# EAGLE design fan control (EAGLE 9.3.2)
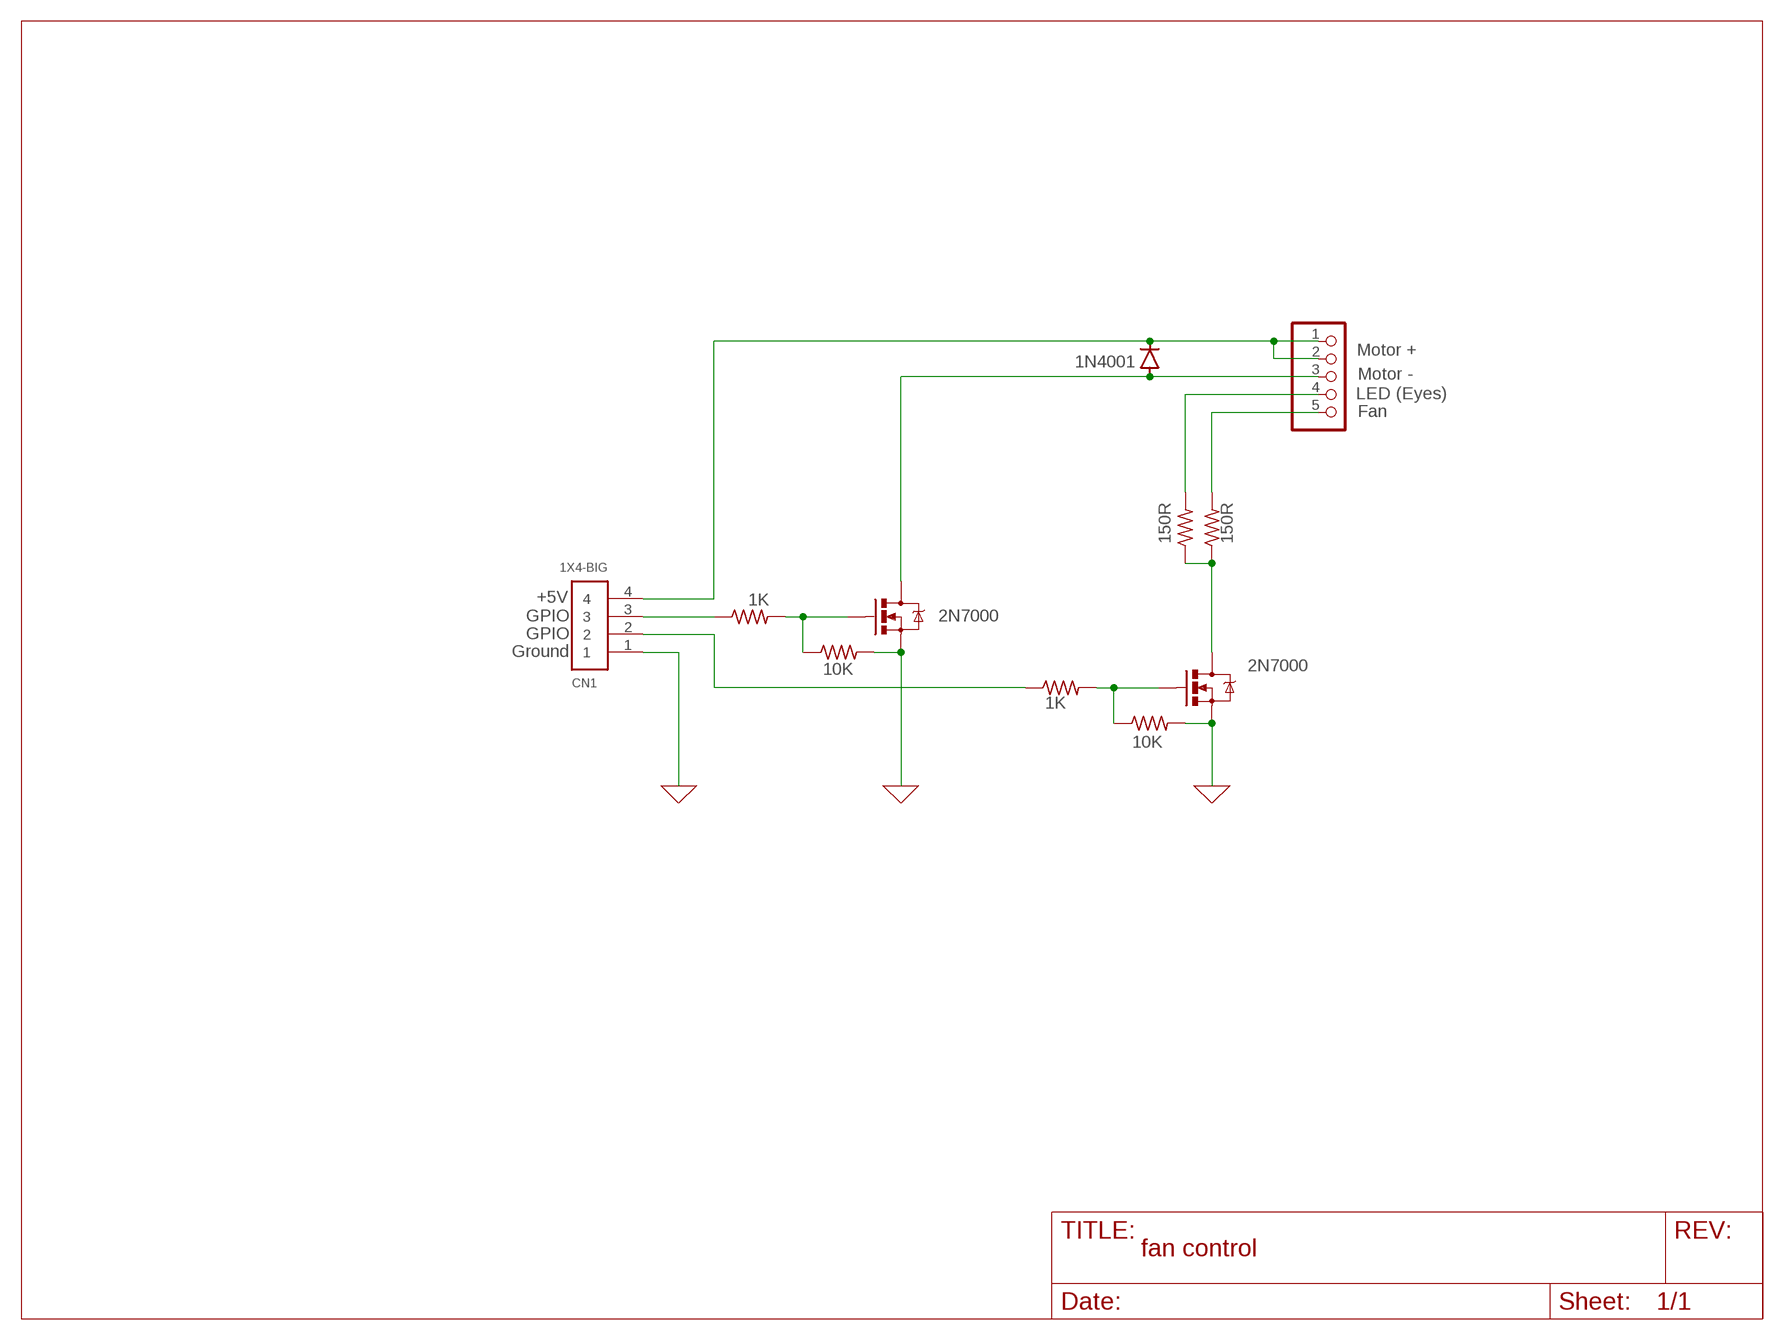
[diagram p0: schematic, sheet 1]

## Parts
CN1  1X4-BIG  [1X04-BIG]
D1  1N4001  1N4004  [DO-41]
JP1  PINHD-1X5  [1X05]
Q1  MOSFET-NCHANNEL2N7000  [TO-92]
Q2  MOSFET-NCHANNEL2N7000  [TO-92]
R1  1K  R-US_0207/10  [0207/10]
R2  10K  R-US_0207/10  [0207/10]
R3  1K  R-US_0207/10  [0207/10]
R4  10K  R-US_0207/10  [0207/10]
R5  150R  R-US_0207/10  [0207/10]
R6  150R  R-US_0207/10  [0207/10]

## Nets
0: CN1.1 Q1.1(S) Q2.1(S) R2.2 R4.2 ; supply symbol labelled GND
N$1: CN1.4 D1.C JP1.1 JP1.2
N$2: Q1.2(G) R1.2 R2.1
N$3: CN1.3 R1.1
N$4: D1.A JP1.3 Q1.3(D)
N$5: Q2.2(G) R3.2 R4.1
N$6: Q2.3(D) R5.1 R6.1
N$7: CN1.2 R3.1
N$8: JP1.5 R6.2
N$9: JP1.4 R5.2

## Notes on the sheet
- Motor +
- Motor -
- LED (Eyes)
- Fan
- +5V
- GPIO | 2N7000
- GPIO
- Ground
- 2N7000

## Library data of the parts
CN1 = adafruit:1X4: 4-pin connector
D1 = Diodes:1N4004: DIODE GEN PURP 400V 1A DO41 Manufacturer's datasheet <https://www.mccsemi.com/pdf/Products/1N4001-1N4007(DO-41).pdf>; CREATED_BY: PCBLayout.com; DIGIKEY_PART_NUMBER: 1N4004MSCT-ND; MANUFACTURER: Micro Commercial Co; MPN: 1N4004; PACKAGE: DO-41
JP1 = pinhead:PINHD-1X5: PIN HEADER
Q1 Q2 = digikey:MOSFET-NCHANNEL: Common NMOSFET Parts MFG P/N Store ID Prod ID FDD8780 TRANS-09984 SI7820DN TRANS-11055 FDS6630A IC-08089 2N7002PW TRANS-11151 FQP30N06L COM-10213 TRANS-10060 BSS123LT1G TRANS-08345 BSS138 TRANS-00830 BS170 2N7000
R1-R6 = adafruit:R-US_: RESISTOR, American symbol

## Board
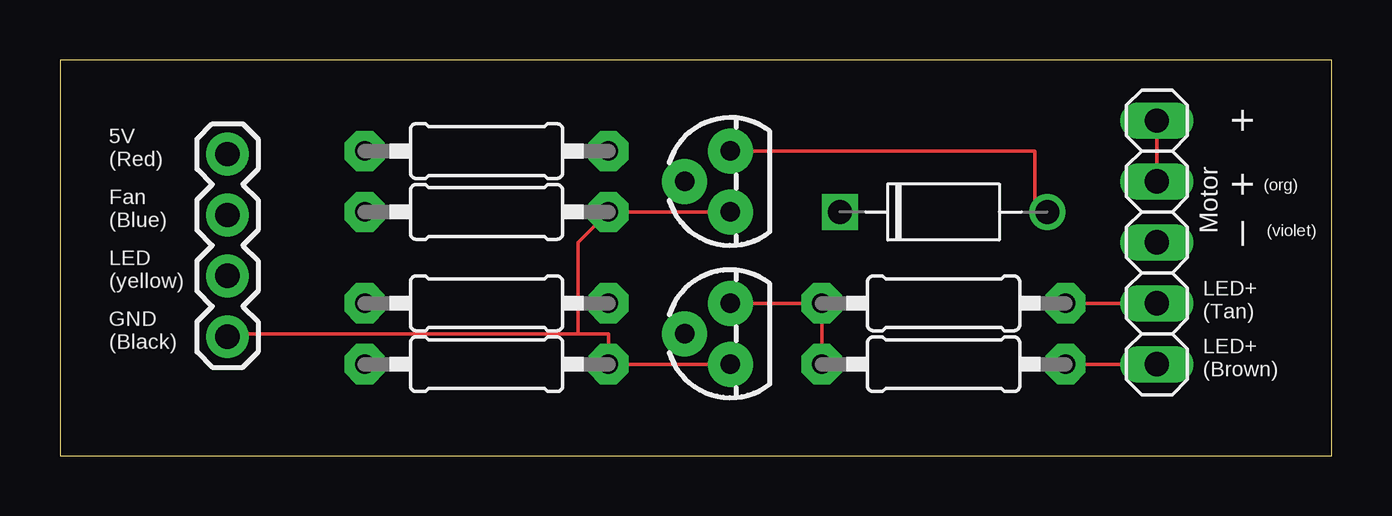
[diagram p1: board, top side]
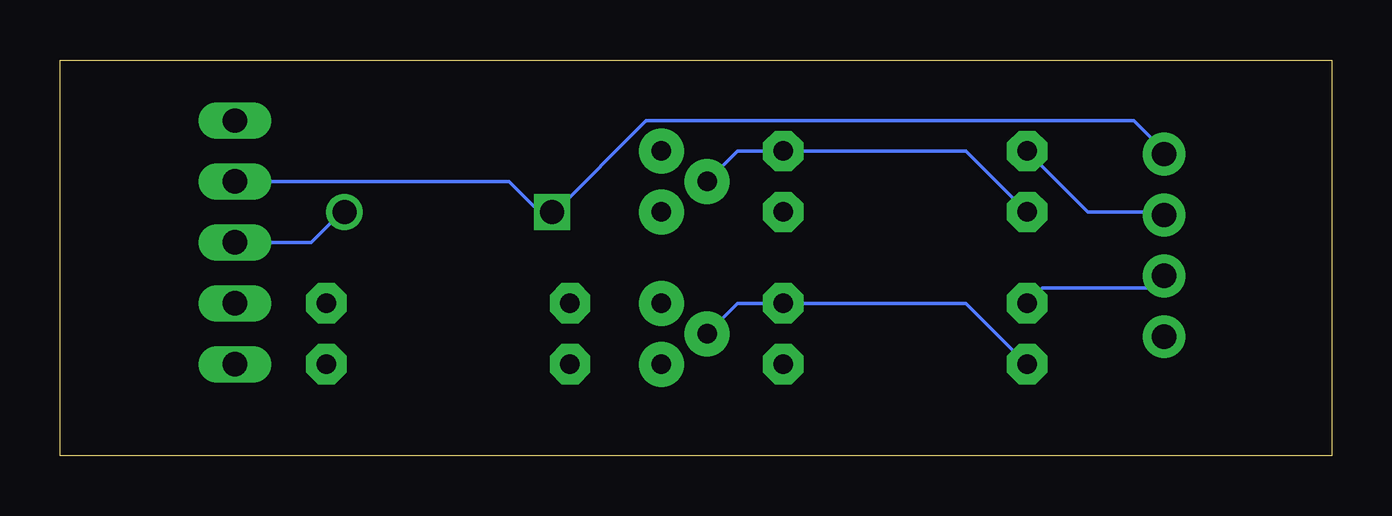
[diagram p2: board, bottom side, seen from below]

Size 53.01 x 16.5 mm. Coordinates in mm from the lower left corner, seen from the top.
Outline: 0,0 53.01,0 53.01,16.5 0,16.5 0,0
Copper layers (1*16): Top 0.035mm / dielectric 1.5mm / Bottom 0.035mm
Design rules "default": minimum track width 6mil, minimum drill 0.35mm, track to track 6mil, track to pad 6mil, pad to pad 6mil, via to via 6mil, smd to smd 6mil, copper to edge 40mil, drill to drill 6mil, minimum pad ring 10mil, minimum via ring 8mil, stop-mask expansion 4mil, vias tented up to drill 0mil, thermal gap 10mil

### Footprints (pad centres in the part's own frame; a part is rotated, then mirrored left to right if it is on the bottom)
1X04-BIG = drill 1.016 pad 1.778: 1 0,0; 2 2.54,0; 3 5.08,0; 4 7.62,0
DO-41 = drill 1: A 4.325,0 | drill 1 square: C -4.325,0
1X05 = drill 1.016 long: 1 -5.08,0; 2 -2.54,0; 3 0,0; 4 2.54,0; 5 5.08,0
TO-92 = drill 0.813 pad 1.88: 1 -1.27,0; 2 0,1.905; 3 1.27,0
0207/10 = drill 0.813 pad 1.676 octagon: 1 -5.08,0; 2 5.08,0

### Placement (x,y rotation side)
CN1  6.99,4.95 90 top
D1  36.83,10.16 0 top
JP1  45.72,8.89 270 top
Q1  27.94,11.43 90 top
Q2  27.94,5.08 90 top
R1  17.78,12.7 0 top
R2  17.78,10.16 0 top
R3  17.78,6.35 0 top
R4  17.78,3.81 0 top
R5  36.83,6.35 0 top
R6  36.83,3.81 0 top

### Tracks (layer width: path | path; a pad name or v marks a point on that pad's centre or on a via)
0
  Top 0.152: Q1.1 R2.2 21.59,8.89 21.59,5.08 | Q2.1 R4.2 22.86,5.08 21.59,5.08 | 21.59,5.08 6.99,5.08 CN1.1
N$1
  Top 0.152: JP1.2 JP1.1
  Bottom 0.152: JP1.2 34.29,11.43 33.02,10.16 D1.C 32.38,10.16 28.57,13.97 8.26,13.97 6.99,12.7 CN1.4
N$2
  Bottom 0.152: R2.1 15.24,12.7 R1.2 24.77,12.7 Q1.2
N$3
  Bottom 0.152: R1.1 10.16,10.16 6.99,10.16 CN1.3
N$4
  Top 0.152: Q1.3 40.64,12.7 40.64,10.16 D1.A
  Bottom 0.152: JP1.3 42.55,8.89 41.27,10.16 D1.A
N$5
  Bottom 0.152: R4.1 15.24,6.35 R3.2 24.77,6.35 Q2.2
N$6
  Top 0.152: R6.1 R5.1 Q2.3
N$7
  Bottom 0.152: R3.1 12.06,6.98 6.99,6.98 CN1.2
N$8
  Top 0.152: R6.2 JP1.5
N$9
  Top 0.152: R5.2 JP1.4

### Text on the board
tNames: + | 5V / (Red) | (org) | + | Fan / (Blue) | Motor | (violet) | _ | LED / (yellow) | LED+ / (Tan) | GND / (Black) | LED+ / (Brown)